# EAGLE schematic IO Valve testing (EAGLE 9.2.2)
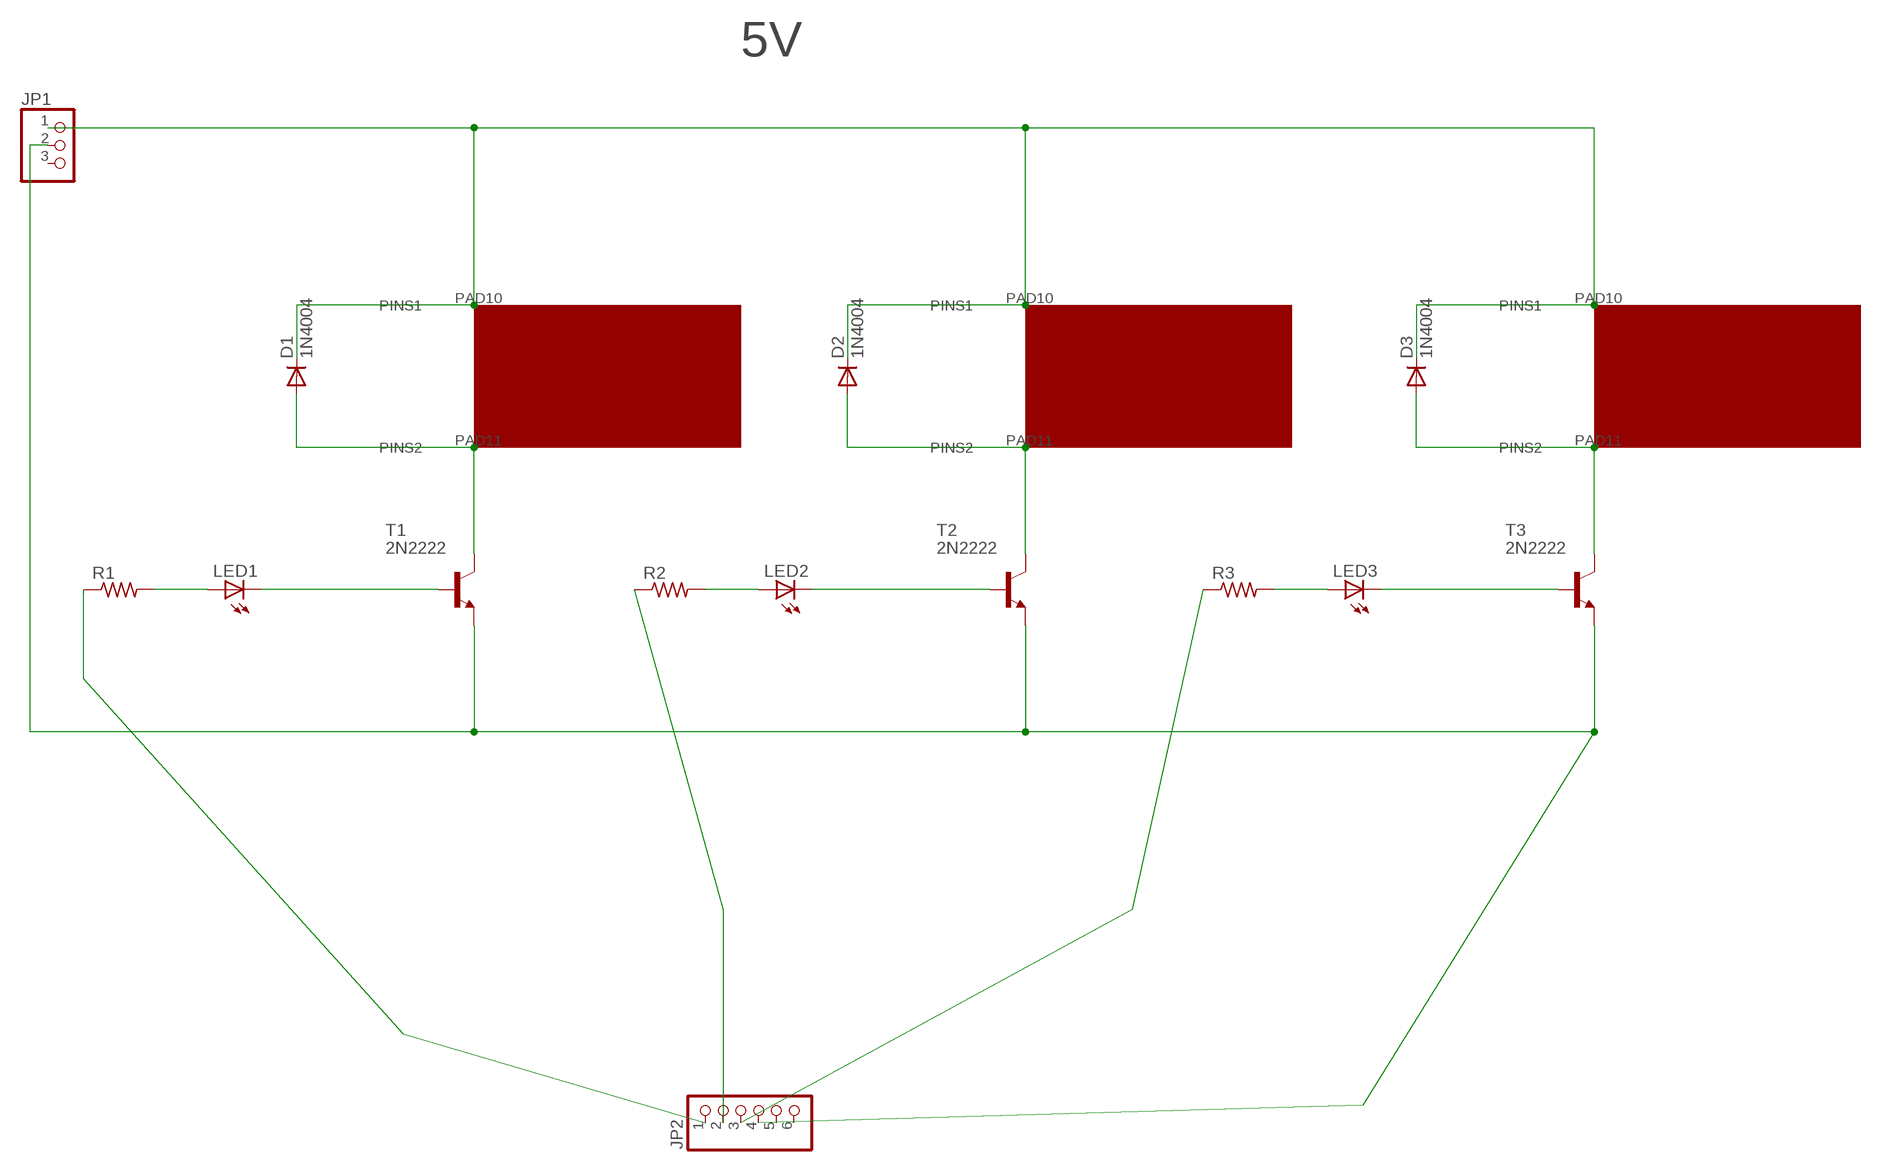
[diagram p0: schematic, sheet 1]

## Parts
D1  1N4004  [DO41-10]
D2  1N4004  [DO41-10]
D3  1N4004  [DO41-10]
JP1  PINHD-1X3  [1X03]
JP2  PINHD-1X6  [1X06]
LED1  LED5MM  [LED5MM]
LED2  LED5MM  [LED5MM]
LED3  LED5MM  [LED5MM]
R1  R-US_0207/10  [0207/10]
R2  R-US_0207/10  [0207/10]
R3  R-US_0207/10  [0207/10]
T1  2N2222  [TO92-EBC-OVAL]
T2  2N2222  [TO92-EBC-OVAL]
T3  2N2222  [TO92-EBC-OVAL]
U$1  VALVE  [VALVTEST2]
U$2  VALVE  [VALVTEST2]
U$3  VALVE  [VALVTEST2]

## Nets
5V: D1.C D2.C D3.C JP1.1 U$1.PAD10(PINS1) U$2.PAD10(PINS1) U$3.PAD10(PINS1)
GND: JP1.2 JP2.4 T1.E T2.E T3.E
N$1: D1.A T1.C U$1.PAD11(PINS2)
N$2: LED1.K(C) T1.B
N$3: LED1.A R1.2
N$5: D2.A T2.C U$2.PAD11(PINS2)
N$6: LED2.K(C) T2.B
N$7: LED2.A R2.2
N$9: D3.A T3.C U$3.PAD11(PINS2)
N$10: LED3.K(C) T3.B
N$11: LED3.A R3.2
VALVEGPIO1: JP2.1 R1.1
VALVEGPIO2: JP2.2 R2.1
VALVEGPIO3: JP2.3 R3.1
Unconnected: JP1.3 JP2.5 JP2.6

## Library data of the parts
D1-D3 = adafruit:1N4004: DIODE General purpose 1N400x type rectifier (With bigger pads) http://www.ladyada.net/library/pcb/eaglelibrary.html
JP1 = adafruit:PINHD-1X3: PIN HEADER
JP2 = adafruit:PINHD-1X6: PIN HEADER
LED1-LED3 = adafruit:LED: LED OSRAM: - CHIPLED LG R971, LG N971, LY N971, LG Q971, LY Q971, LO R971, LY R971 LH N974, LH R974 LS Q976, LO Q976, LY Q976 LO Q996 - Hyper CHIPLED LW Q18S LB Q993, LB Q99A, LB R99A - SideLED LS A670, LO A670, LY A670, LG A670, LP A670 LB A673, LV A673, LT A673, LW A673 LH A674 LY A675 LS A676, LA A676, LO A676, LY A676, LW A676 LS A679, LY A679, LG A679 - Hyper Micro SIDELED® LS Y876, LA Y876, LO Y876, LY Y876 LT Y87S - SmartLED LW L88C, LW L88S LB L89C, LB L89S, LG L890 LS L89K, LO L89K, LY L89K LS L896, LA L896, LO L896, LY L896 - TOPLED LS T670, LO T670, LY T670, LG T670, LP T670 LSG T670, LSP T670, LSY T670, LOP T670, LYG T670 LG T671, LOG T671, LSG T671 LB T673, LV T673, LT T673, LW T673 LH T674 LS T676, LA T676, LO T676, LY T676, LB T676, LH T676, LSB T676, LW T676 LB T67C, LV T67C, LT T67C, LS T67K, LO T67K, LY T67K, LW E67C LS E67B, LA E67B, LO E67B, LY E67B, LB E67C, LV E67C, LT E67C LW T67C LS T679, LY T679, LG T679 LS T770, LO T770, LY T770, LG T770, LP T770 LB T773, LV T773, LT T773, LW T773 LH T774 LS E675, LA E675, LY E675, LS T675 LS T776, LA T776, LO T776, LY T776, LB T776 LHGB T686 LT T68C, LB T68C - Hyper Mini TOPLED® LB M676 - Mini TOPLED Santana® LG M470 LS M47K, LO M47K, LY M47K Source: http://www.osram.convergy.de/
R1-R3 = adafruit:R-US_: RESISTOR, American symbol
T1-T3 = adafruit:2N2222: NPN TRANSISTOR Big oval pads
U$1-U$3 = local eagle library:VALVE: pn eumatic valve